# Altium schematic sheet Power_Supplies.SchDoc: =DocumentName
size A4; SPICEModelCache: <root> / <DocumentId>GVTSYOHF</DocumentId> / <CacheFrame Number="0"> / <Model Name="0603_155060gs75300" Kind="CKT"> / <Text>******** / .subckt 0603_155060GS75300 1 2 / D1 1 2 SMSW / .MODEL SMSW D / + IS=695.94E-6 / + N=5 / + RS=2.4677 / + IKF=16.109E-12 / + CJO=1.0000E-12 / + M=.3333 / + VJ=.75 / + BV=5 / + IBV=10.00E-6 / + TT=5.0000E-9 / .ends</Text> / </Model> / <Model Name="0603_155060rs75300" Kind="CKT"> / <Text>******** / .subckt 0603_155060RS75300 1 2 / D1 1 2 SMSW / .MODEL SMSW D / + IS=824.78E-18 / + N=2.2038 / + RS=.38595 / + IKF=240.07E-6 / + CJO=1.0000E-12 / + M=.3333 / + VJ=.75 / + BV=5 / + IBV=10.00E-6 / + TT=5.0000E-9 / .ends</Text> / </Model> / </CacheFrame> / </root>; DocumentNumber: 1; Revision: 0; SheetNumber: 3; SheetTotal: 15; Last modified by: Krzysztof Belewicz
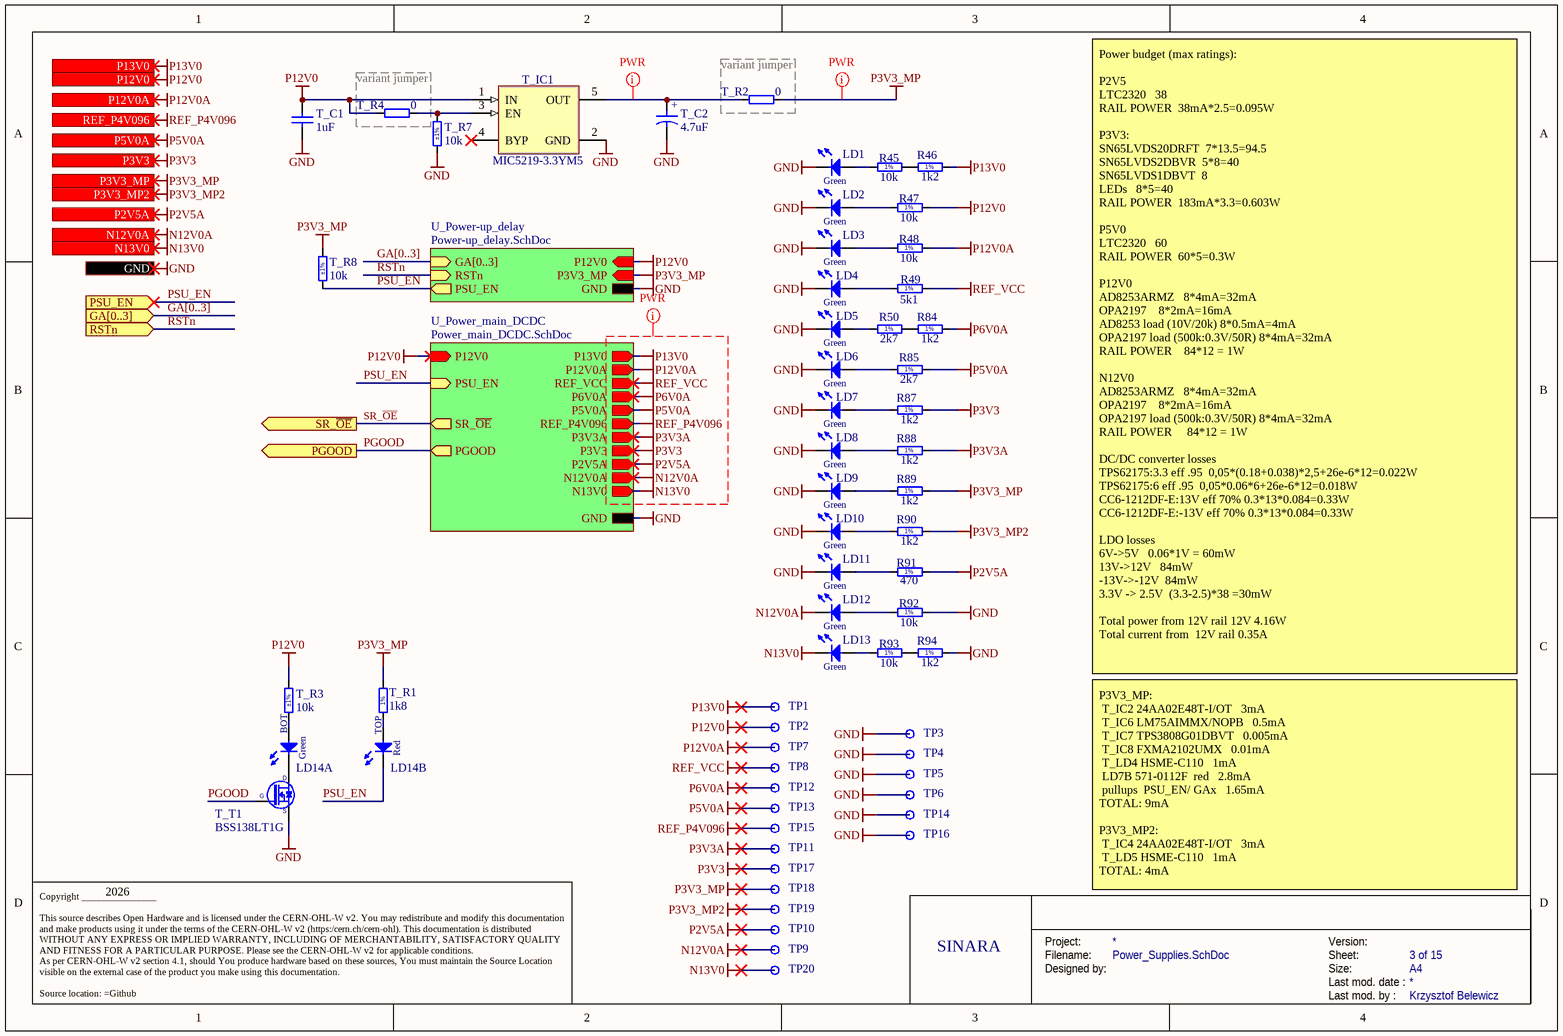
[diagram p0: Power_Supplies.SchDoc]

## Parts
LD1  Green  [LED_KINGBRIGHT_KPH-1608CGCK]
LD2  Green  [LED_KINGBRIGHT_KPH-1608CGCK]
LD3  Green  [LED_KINGBRIGHT_KPH-1608CGCK]
LD4  Green  [LED_KINGBRIGHT_KPH-1608CGCK]
LD5  Green  [LED_KINGBRIGHT_KPH-1608CGCK]
LD6  Green  [LED_KINGBRIGHT_KPH-1608CGCK]
LD7  Green  [LED_KINGBRIGHT_KPH-1608CGCK]
LD8  Green  [LED_KINGBRIGHT_KPH-1608CGCK]
LD9  Green  [LED_KINGBRIGHT_KPH-1608CGCK]
LD10  Green  [LED_KINGBRIGHT_KPH-1608CGCK]
LD11  Green  [LED_KINGBRIGHT_KPH-1608CGCK]
LD12  Green  [LED_KINGBRIGHT_KPH-1608CGCK]
LD13  Green  [LED_KINGBRIGHT_KPH-1608CGCK]
LD14  Red/Green  [LED_DIALIGHT_571-0112F]  (value not drawn)  (parts A,B of 2)
R45  10k  [RESC1005X40N]
R46  1k2  [RESC1608X55N]
R47  10k  [RESC1005X40N]
R48  10k  [RESC1005X40N]
R49  5k1  [RESC1005X40N]
R50  2k7  [RESC1608X55N]
R84  1k2  [RESC1608X55N]
R85  2k7  [RESC1608X55N]
R87  1k2  [RESC1608X55N]
R88  1k2  [RESC1608X55N]
R89  1k2  [RESC1608X55N]
R90  1k2  [RESC1608X55N]
R91  470  [RESC1005X40N]
R92  10k  [RESC1005X40N]
R93  10k  [RESC1005X40N]
R94  1k2  [RESC1608X55N]
T_C1  1uF  [CAPC1608X87N]
T_C2  4.7uF  [CAPMP3216X180N]
T_IC1  MIC5219-3.3YM5  [SOT95P280X145-5N]
T_R1  1k8  [RESC1608X55N]
T_R2  0  [RESC1005X40N]
T_R3  10k  Tolerance: ±1%  [RESC1005X40N]
T_R4  0  [RESC1005X40N]
T_R7  10k  Tolerance: ±1%  [RESC1005X40N]
T_R8  10k  Tolerance: ±1%  [RESC1005X40N]
T_T1  BSS138LT1G  [SOT95P240X110-3N]
TP1  Test Point  [TPS127]  (value not drawn)  (no BOM)
TP2  Test Point  [TPS127]  (value not drawn)  (no BOM)
TP3  Test Point  [TPS127]  (value not drawn)  (no BOM)
TP4  Test Point  [TPS127]  (value not drawn)  (no BOM)
TP5  Test Point  [TPS127]  (value not drawn)  (no BOM)
TP6  Test Point  [TPS127]  (value not drawn)  (no BOM)
TP7  Test Point  [TPS127]  (value not drawn)  (no BOM)
TP8  Test Point  [TPS127]  (value not drawn)  (no BOM)
TP9  Test Point  [TPS127]  (value not drawn)  (no BOM)
TP10  Test Point  [TPS127]  (value not drawn)  (no BOM)
TP11  Test Point  [TPS127]  (value not drawn)  (no BOM)
TP12  Test Point  [TPS127]  (value not drawn)  (no BOM)
TP13  Test Point  [TPS127]  (value not drawn)  (no BOM)
TP14  Test Point  [TPS127]  (value not drawn)  (no BOM)
TP15  Test Point  [TPS127]  (value not drawn)  (no BOM)
TP16  Test Point  [TPS127]  (value not drawn)  (no BOM)
TP17  Test Point  [TPS127]  (value not drawn)  (no BOM)
TP18  Test Point  [TPS127]  (value not drawn)  (no BOM)
TP19  Test Point  [TPS127]  (value not drawn)  (no BOM)
TP20  Test Point  [TPS127]  (value not drawn)  (no BOM)

## Blocks framed on the sheet
variant jumper: T_R4
variant jumper: T_R2

## Sub-sheets
U_Power-up_delay = Power-up_delay.SchDoc: GA[0..3] (in), RSTn (in), GND, PSU_EN (out), P3V3_MP (in), P12V0 (in)
U_Power_main_DCDC = Power_main_DCDC.SchDoc: P12V0 (in), GND, PSU_EN (in), REF_P4V096 (out), P13V0 (out), P3V3 (out), N13V0 (out), P2V5A (out), N12V0A (out), P5V0A (out), P12V0A (out), SR_~{OE} (out), P3V3A (out), P6V0A (out), REF_VCC (out), PGOOD (out)

## Ports
GA[0..3] (in), GND, N12V0A (out), N13V0 (out), P2V5A (out), P3V3 (out), P3V3_MP2 (in), P3V3_MP (in), P5V0A (out), P12V0 (in), P12V0A (out), P13V0 (out), PGOOD (out), PSU_EN (in), REF_P4V096 (out), RSTn (in), SR_~{OE} (out)

## Nets
GND: LD1.1(C) LD2.1(C) LD3.1(C) LD4.1(C) LD5.1(C) LD6.1(C) LD7.1(C) LD8.1(C) LD9.1(C) LD10.1(C) LD11.1(C) R92.2 R94.2 T_C1.1 T_C2.2 T_IC1.2(GND) T_R7.1 T_T1.2(S) TP3.1 TP4.1 TP5.1 TP6.1 TP14.1 TP16.1 ; port GND, sheet U_Power-up_delay/GND, sheet U_Power_main_DCDC/GND
N12V0A: LD12.1(C) TP9.1 ; port N12V0A, sheet U_Power_main_DCDC/N12V0A
N13V0: LD13.1(C) TP20.1 ; port N13V0, sheet U_Power_main_DCDC/N13V0
P2V5A: R91.1 TP10.1 ; port P2V5A, sheet U_Power_main_DCDC/P2V5A
P3V3: R87.2 TP17.1 ; port P3V3, sheet U_Power_main_DCDC/P3V3
P3V3_MP: R89.2 T_R1.2 T_R2.2 T_R8.2 TP18.1 ; port P3V3_MP, sheet U_Power-up_delay/P3V3_MP
P3V3_MP2: R90.2 TP19.1 ; port P3V3_MP2
P3V3A: R88.2 TP11.1 ; sheet U_Power_main_DCDC/P3V3A
P5V0A: R85.2 TP13.1 ; port P5V0A, sheet U_Power_main_DCDC/P5V0A
P6V0A: R84.2 TP12.1 ; sheet U_Power_main_DCDC/P6V0A
P12V0: R47.2 T_C1.2 T_IC1.1(IN) T_R3.2 T_R4.1 TP2.1 ; port P12V0, sheet U_Power-up_delay/P12V0, sheet U_Power_main_DCDC/P12V0
P12V0A: R48.2 TP7.1 ; port P12V0A, sheet U_Power_main_DCDC/P12V0A
P13V0: R46.2 TP1.1 ; port P13V0, sheet U_Power_main_DCDC/P13V0
REF_P4V096: TP15.1 ; port REF_P4V096, sheet U_Power_main_DCDC/REF_P4V096
REF_VCC: R49.2 TP8.1 ; sheet U_Power_main_DCDC/REF_VCC
PGOOD: T_T1.1(G) ; port PGOOD, sheet U_Power_main_DCDC/PGOOD
PSU_EN: LD14.3(C) T_R8.1 ; port PSU_EN, sheet U_Power-up_delay/PSU_EN, sheet U_Power_main_DCDC/PSU_EN
RSTn: port RSTn, sheet U_Power-up_delay/RSTn
SR_~{OE}: port SR_~{OE}, sheet U_Power_main_DCDC/SR_~{OE}
NetLD1_2: LD1.2(A) R45.1
NetLD2_2: LD2.2(A) R47.1
NetLD3_2: LD3.2(A) R48.1
NetLD4_2: LD4.2(A) R49.1
NetLD5_2: LD5.2(A) R50.1
NetLD6_2: LD6.2(A) R85.1
NetLD7_2: LD7.2(A) R87.1
NetLD8_2: LD8.2(A) R88.1
NetLD9_2: LD9.2(A) R89.1
NetLD10_2: LD10.2(A) R90.1
NetLD11_2: LD11.2(A) R91.2
NetLD12_2: LD12.2(A) R92.1
NetLD13_2: LD13.2(A) R93.1
NetLD14_1: LD14.1(C) T_T1.3(D)
NetLD14_2: LD14.2(A) T_R3.1
NetLD14_4: LD14.4(A) T_R1.1
NetR45_2: R45.2 R46.1
NetR50_2: R50.2 R84.1
NetR93_2: R93.2 R94.1
NetT_C2_1: T_C2.1 T_IC1.5(OUT) T_R2.1
NetT_IC1_3: T_IC1.3(EN) T_R4.2 T_R7.2

Not connected (* = marked no-connect by the designer): T_IC1 4(BYP)*

## Buses and harness runs
bus GA[0..3] = port GA[0..3]
bus GA[0..3] = sheet U_Power-up_delay/GA[0..3]

## Layout directives
net class PWR: N12V0A, N13V0, NetT_C2_1, P2V5A, P3V3, P3V3_MP, P3V3A, P5V0A, P6V0A, P12V0A, P13V0, REF_P4V096, REF_VCC

## Notes on the sheet
- Power budget (max ratings):
  P2V5
  LTC2320			38
  RAIL POWER		38mA*2.5=0.095W
  P3V3:
  SN65LVDS20DRFT		7*13.5=94.5
  SN65LVDS2DBVR		5*8=40
  SN65LVDS1DBVT		8
  LEDs			8*5=40
  RAIL POWER		183mA*3.3=0.603W
  P5V0
  LTC2320			60
  RAIL POWER		60*5=0.3W
  P12V0
  AD8253ARMZ 		8*4mA=32mA
  OPA2197 			8*2mA=16mA
  AD8253 load (10V/20k)	8*0.5mA=4mA
  OPA2197 load (500k:0.3V/50R)	8*4mA=32mA
  RAIL POWER 		 84*12 = 1W
  N12V0
  AD8253ARMZ 		8*4mA=32mA
  OPA2197 			8*2mA=16mA
  OPA2197 load (500k:0.3V/50R)	8*4mA=32mA
  RAIL POWER  		 84*12 = 1W
  DC/DC converter losses
  TPS62175:3.3 eff .95		0,05*(0.18+0.038)*2,5+26e-6*12=0.022W
  TPS62175:6 eff .95		0,05*0.06*6+26e-6*12=0.018W
  CC6-1212DF-E:13V eff 70%	0.3*13*0.084=0.33W
  CC6-1212DF-E:-13V eff 70%	0.3*13*0.084=0.33W
  LDO losses
  6V->5V			0.06*1V = 60mW
  13V->12V			84mW
  -13V->-12V		84mW
  3.3V -> 2.5V		(3.3-2.5)*38 =30mW
  Total power from 12V rail	12V 4.16W
  Total current from  12V rail	0.35A
- 2026
- P3V3_MP:
  T_IC2	24AA02E48T-I/OT			3mA
  T_IC6	LM75AIMMX/NOPB			0.5mA
  T_IC7	TPS3808G01DBVT			0.005mA
  T_IC8	FXMA2102UMX			0.01mA
  T_LD4	HSME-C110			1mA
  LD7B	571-0112F	 red			2.8mA
  pullups 	PSU_EN/ GAx			1.65mA
  TOTAL: 9mA
  P3V3_MP2:
  T_IC4	24AA02E48T-I/OT			3mA
  T_LD5	HSME-C110			1mA
  TOTAL: 4mA
- SINARA
- Project:
- Designed by:
- Filename:
- Size:
- Version:
- Last mod. date :
- Sheet:
- A4
- Copyright _______________
  This source describes Open Hardware and is licensed under the CERN-OHL-W v2. You may redistribute and modify this documentation and make products using it under the terms of the CERN-OHL-W v2 (https:/cern.ch/cern-ohl). This documentation is distributed WITHOUT ANY EXPRESS OR IMPLIED WARRANTY, INCLUDING OF MERCHANTABILITY, SATISFACTORY QUALITY AND FITNESS FOR A PARTICULAR PURPOSE. Please see the CERN-OHL-W v2 for applicable conditions.
  As per CERN-OHL-W v2 section 4.1, should You produce hardware based on these sources, You must maintain the Source Location visible on the external case of the product you make using this documentation.
  Source location: =Github
- Last mod. by :
- (in symbol CTE3216-18_4.7UF_10V_10%_AVX_TPSA475K010T1400) +
- (in symbol LED_DIALIGHT_571-0112F, part A) BOT; Green
- (in symbol LED_DIALIGHT_571-0112F, part B) TOP; Red
- (in symbol R0402_5K1_1%_0.0625W_100PPM) 1%
- (in symbol R0402_10K_1%_0.0625W_100PPM) 1%
- (in symbol R0402_470R_1%_0.0625W_100PPM) 1%
- (in symbol R0603_1K2_1%_0.1W_100PPM) 1%
- (in symbol R0603_1K8_1%_0.1W_100PPM) 1%
- (in symbol R0603_2K7_1%_0.1W_100PPM) 1%

## Library data of the parts
LD1-LD13 = LED_KINGBRIGHT_KPH-1608CGCK: LED Green 1C 2A; Part Description: SMD Green LED, Case 1.6mmX0.8mm(0603), 0.65mm Thickness; PressFit: No; Bonding: No; Part Number: LED_KINGBRIGHT_KPH-1608CGCK; Component Kind: Standard; Component Type: Standard; Color: Green; PackageDescription: SMT Green LED, Case 0603, Body L 1.6 x W 0.8mm H 0.65mm; Manufacturer: KINGBRIGHT; Manufacturer Part Number: KPH-1608CGCK; Pin Count: 2; Mounted: Yes; Socket: No; SMD: Yes; Sense: No; ComponentHeight: 0.65mm; HelpURL: \\cern.ch\dfs\Applications\Altium\Datasheets\LED_KINGBRIGHT_KPH-1608CGCK.pdf; Author: CERN DEM JLC; CreateDate: 03/07/2017; LatestRevisionDate: 03/07/2017
LD14 = LED_DIALIGHT_571-0112F: 2x LED  Botom Green, Top Red; Part Description: Dual 2mm  LEDs, Red Top,Green Bot, CBI® Circuit Board Indicator (Without positioning pins); PressFit: No; Bonding: No; Part Number: LED_DIALIGHT_571-0112F; Component Kind: Standard; Component Type: Standard; Color: Red/Green; PackageDescription: 2x 2mm LED (Top: Red, Bot: Green) PCB Edge Mounting (Without positioning pins) DIALIGHT 571 Serie; Manufacturer: DIALIGHT; Manufacturer Part Number: 571-0112F; Pin Count: 4; Mounted: Yes; Socket: No; SMD: No; Sense: No; ComponentHeight: 8.6mm; HelpURL: \\cern.ch\dfs\Applications\Altium\Datasheets\LED_DIALIGHT_571-0112F.pdf; Author: CERN DEM JLC; CreateDate: 09.11.2009; LatestRevisionDate: 17.03.2010
R45 R47 R48 R92 R93 T_R3 T_R7 T_R8 = R0402_10K_1%_0.0625W_100PPM: Resistor - 1%; Part Description: General Purpose Thick Film Chip Resistor; Manufacturer: GENERIC; Manufacturer1 Part Number: 232270671003L; TC: ±100ppm/°C; PressFit: No; Part Number: R0402_10K_1%_0.0625W_100PPM; Component Kind: Standard; Component Type: Standard; Pin Count: 2; Value: 10k; Status: Not Recommended; Power: 0.0625W; Manufacturer Part Number: R0402_10K_1%_0.0625W_100PPM; Case: 0402; Mounted: Yes; Sense: No; Socket: No; SMD: Yes; Manufacturer1 Example: YAGEO PHYCOMP; Manufacturer1 ComponentHeight: 0.4mm; HelpURL: \\cern.ch\dfs\Applications\Altium\Datasheets\R0402_Phycomp_RC0402.pdf; Author: CERN DEM JLC; CreateDate: 03.12.2007; LatestRevisionDate: 17.10.2012
  R45 R47 R48 R92 R93: Tolerance: ±1%
R46 R84 R87-R90 R94 = R0603_1K2_1%_0.1W_100PPM: Resistor - 1%; Part Description: General Purpose Thick Film Chip Resistor; Manufacturer: GENERIC; Manufacturer1 Part Number: NRC06F1201TRF; Power: 0.1W; TC: ±100ppm/°C; Part Number: R0603_1K2_1%_0.1W_100PPM; Component Kind: Standard; Component Type: Standard; Pin Count: 2; Value: 1k2; Status: Preferred; Tolerance: ±1%; Manufacturer Part Number: R0603_1K2_1%_0.1W_100PPM; Case: 0603; Mounted: Yes; Sense: No; Socket: No; SMD: Yes; Manufacturer1 Example: NIC COMPONENT; Manufacturer1 ComponentHeight: 0.55mm; HelpURL: \\cern.ch\dfs\Applications\Altium\Datasheets\R0603_NIC_NRC.pdf; Author: CERN DEM JLC; CreateDate: 03.12.2007; LatestRevisionDate: 13.03.2008
R49 = R0402_5K1_1%_0.0625W_100PPM: Resistor - 1%; Part Description: General Purpose Thick Film Chip Resistor; Manufacturer: GENERIC; Manufacturer1 Part Number: 232270675102L; TC: ±100ppm/°C; PressFit: No; Part Number: R0402_5K1_1%_0.0625W_100PPM; Component Kind: Standard; Component Type: Standard; Pin Count: 2; Value: 5k1; Status: Not Recommended; Power: 0.0625W; Tolerance: ±1%; Manufacturer Part Number: R0402_5K1_1%_0.0625W_100PPM; Case: 0402; Mounted: Yes; Sense: No; Socket: No; SMD: Yes; Manufacturer1 Example: YAGEO PHYCOMP; Manufacturer1 ComponentHeight: 0.4mm; HelpURL: \\cern.ch\dfs\Applications\Altium\Datasheets\R0402_Phycomp_RC0402.pdf; Author: CERN DEM JLC; CreateDate: 03.12.2007; LatestRevisionDate: 17.10.2012
R50 R85 = R0603_2K7_1%_0.1W_100PPM: Resistor - 1%; Part Description: General Purpose Thick Film Chip Resistor; Manufacturer: GENERIC; Manufacturer1 Part Number: RC0603FR-072K7L; Power: 0.1W; TC: ±100ppm/°C; Part Number: R0603_2K7_1%_0.1W_100PPM; Component Kind: Standard; Component Type: Standard; Pin Count: 2; Value: 2k7; Status: Preferred; Tolerance: ±1%; Manufacturer Part Number: R0603_2K7_1%_0.1W_100PPM; Case: 0603; Mounted: Yes; Sense: No; Socket: No; SMD: Yes; Manufacturer1 Example: YAGEO PHYCOMP; Manufacturer1 ComponentHeight: 0.55mm; HelpURL: \\cern.ch\dfs\Applications\Altium\Datasheets\R0603_PHYCOMP_RC0603.pdf; Author: CERN DEM JLC; CreateDate: 02.05.2011; LatestRevisionDate: 02.05.2011
R91 = R0402_470R_1%_0.0625W_100PPM: Resistor - 1%; Part Description: General Purpose Thick Film Chip Resistor; Manufacturer: GENERIC; Manufacturer1 Part Number: 232270674701L; TC: ±100ppm/°C; PressFit: No; Part Number: R0402_470R_1%_0.0625W_100PPM; Component Kind: Standard; Component Type: Standard; Pin Count: 2; Value: 470; Status: Not Recommended; Power: 0.0625W; Tolerance: ±1%; Manufacturer Part Number: R0402_470R_1%_0.0625W_100PPM; Case: 0402; Mounted: Yes; Sense: No; Socket: No; SMD: Yes; Manufacturer1 Example: YAGEO PHYCOMP; Manufacturer1 ComponentHeight: 0.4mm; HelpURL: \\cern.ch\dfs\Applications\Altium\Datasheets\R0402_Phycomp_RC0402.pdf; Author: CERN DEM JLC; CreateDate: 03.12.2007; LatestRevisionDate: 17.10.2012
T_C1 = CC0603_1UF_25V_10%_X7R: Non-polarised capacitor; Part Description: SMD Multilayer Chip Ceramic Capacitor; Manufacturer: GENERIC; Manufacturer1 Part Number: GRM188R71E105KA12D; Voltage: 25V; TC: X7R; Tolerance: ±10%; Part Number: CC0603_1UF_25V_10%_X7R; Component Kind: Standard; Component Type: Standard; Pin Count: 2; Value: 1uF; Status: None; Manufacturer Part Number: CC0603_1UF_25V_10%_X7R; Case: 0603; Mounted: Yes; Socket: No; SMD: Yes; Sense: No; Manufacturer1 Example: MURATA; Manufacturer1 ComponentHeight: 0.9mm; HelpURL: \\cern.ch\dfs\Applications\Altium\Datasheets\CC0603_X7R_MURATA.pdf; Author: CERN DEM JLC; CreateDate: 18.01.2011; LatestRevisionDate: 18.01.2011
T_C2 = CTE3216-18_4.7UF_10V_10%_AVX_TPSA475K010T1400: Polarised capacitor; Part Description: Low ESR 1R4 Automotive Solid Tantalum Chip Capacitor; Manufacturer: AVX; Voltage: 10V; Tolerance: ±10%; Part Number: CTE3216-18_4.7UF_10V_10%_AVX_TPSA475K010T1400; Component Kind: Standard; Component Type: Standard; Pin Count: 2; Value: 4.7uF; Status: Preferred; Manufacturer Part Number: TPSA475K010T1400; Case: A; Mounted: Yes; Socket: No; SMD: Yes; Sense: No; ComponentHeight: 1.8mm; HelpURL: \\cern.ch\dfs\Applications\Altium\Datasheets\CTE-LESR_AVX_TPS-AUTO.pdf; Author: CERN DEM JLC; CreateDate: 23.01.2018; LatestRevisionDate: 23.01.2018
T_IC1 = MIC5219-3.3YM5: 500mA Peak Output LDO Regulator; Part Description: 3.3V 500mA Peak Output Low Drop-Out  (LDO) Regulator; Manufacturer: MICROCHIP TECHNOLOGY; PressFit: No; Bonding: No; Part Number: MIC5219-3.3YM5; Component Kind: Standard; Component Type: Standard; Device: MIC5219-3.3YM5; PackageDescription: SOT, 0.95mm pitch; 5 pin, 1.60mm W X 2.90mm L X 1.45mm H body, IPC Medium Density; Manufacturer Part Number: MIC5219-3.3YM5; Pin Count: 5; Case: SOT23-5; Mounted: Yes; Socket: No; SMD: Yes; Sense: No; ComponentHeight: 1.45mm; HelpURL: \\cern.ch\dfs\Applications\Altium\Datasheets\MIC5219-3.3YM5.pdf; Author: CERN DEM WB; CreateDate: 2019-04-16; LatestRevisionDate: 2019-04-16
T_R1 = R0603_1K8_1%_0.1W_100PPM: Resistor - 1%; Part Description: General Purpose Thick Film Chip Resistor; Manufacturer: GENERIC; Manufacturer1 Part Number: NRC06F1801TRF; Power: 0.1W; TC: ±100ppm/°C; Part Number: R0603_1K8_1%_0.1W_100PPM; Component Kind: Standard; Component Type: Standard; Pin Count: 2; Value: 1k8; Status: Preferred; Tolerance: ±1%; Manufacturer Part Number: R0603_1K8_1%_0.1W_100PPM; Case: 0603; Mounted: Yes; Sense: No; Socket: No; SMD: Yes; Manufacturer1 Example: NIC COMPONENT; Manufacturer1 ComponentHeight: 0.55mm; HelpURL: \\cern.ch\dfs\Applications\Altium\Datasheets\R0603_NIC_NRC.pdf; Author: CERN DEM JLC; CreateDate: 03.12.2007; LatestRevisionDate: 13.03.2008
T_R2 T_R4 = R0402_0R_JUMPER: Resistor; Part Description: 1A (0.05R Max DC Resistance) Zero Ohm Jumper; Manufacturer: GENERIC; Manufacturer1 Part Number: 232270591001L; PressFit: No; Part Number: R0402_0R_JUMPER; Component Kind: Standard; Component Type: Standard; Pin Count: 2; Value: 0; Status: Not Recommended; Manufacturer Part Number: R0402_0R_JUMPER; Case: 0402; Mounted: Yes; Sense: No; Socket: No; SMD: Yes; Manufacturer1 Example: YAGEO PHYCOMP; Manufacturer1 ComponentHeight: 0.4mm; HelpURL: \\cern.ch\dfs\Applications\Altium\Datasheets\R0402_Phycomp_RC0402.pdf; Author: CERN DEM JLC; CreateDate: 03.12.2007; LatestRevisionDate: 17.10.2012
T_T1 = BSS138LT1G: N-CHANNEL MOSFET WITH DIODE; Part Description: 50V, 200mA N-Channel Enhancement Mode Field-Effect Transistor; Manufacturer: ON SEMICONDUCTOR; PressFit: No; Bonding: No; Part Number: BSS138LT1G; Component Kind: Standard; Component Type: Standard; Device: BSS138LT1G; PackageDescription: SOT23, 0.95mm Pitch; 3 Pin, 1.40mm W X 3.00mm L X 1.10mm H body, IPC Medium Density; Manufacturer Part Number: BSS138L; Pin Count: 3; Case: SOT23-3; Mounted: Yes; Socket: No; SMD: Yes; Sense: No; ComponentHeight: 1.11mm; HelpURL: \\cern.ch\dfs\Applications\Altium\Datasheets\BSS138LT1G.pdf; Author: CERN DEM JLC; CreateDate: 23.03.2009; LatestRevisionDate: 25.05.2022
TP1-TP20 = SMD_PAD_1.27X1.27MM: Part Description: 1.27mm x 1.27mm PCB Copper Area (SMD Test Point); Mounted: No; Part Number: SMD_PAD_1.27X1.27MM; Component Type: Standard (No BOM); Pin Count: 1; Family: Test Point; Socket: No; SMD: Yes; Sense: No; Status: None; ComponentHeight: 0mm; HelpURL: Undefined; Author: CERN DEM JLC; CreateDate: 12.01.2008; LatestRevisionDate: 12.01.2008; PackageDescription: 1.27mm x 1.27mm PCB Copper Area (SMD Test Point)